# Altium schematic sheet usb.SchDoc
size A4; SheetNumber: 2; SheetTotal: 2
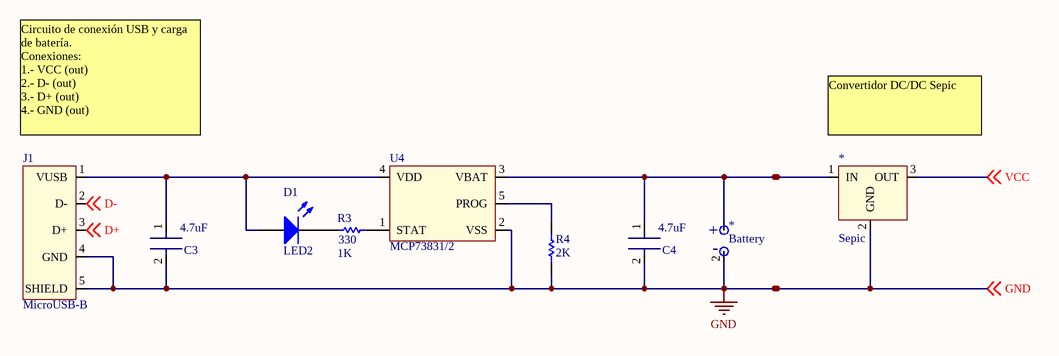
[diagram p0: usb.SchDoc]

## Parts
(Parts that share a designator on the sheet are numbered #1, #2 ... from top to bottom, then left to right.)
*#1  Sepic
*#2  Battery
C3  4.7uF  [Capacitor EIA 1206]
C4  4.7uF  [Capacitor EIA 1206]
D1  LED2  [3.2X1.6X1.1]
J1  MicroUSB-B
R3  330  value 1K  [3216[1206]]
R4  2K  [3216[1206]]
U4  MCP73831/2

## Nets
GND: *#1.2(GND) *#2.2 C3.2 C4.2 J1.4(GND) J1.5(SHIELD) R4.1 U4.2(VSS) ; off-sheet GND
D+: J1.3(D+) ; off-sheet D+
D-: J1.2(D-) ; off-sheet D-
VCC: *#1.3(OUT) ; off-sheet VCC
Net*#1_1: *#1.1(IN) *#2.1 C4.1 U4.3(VBAT)
NetC3_1: C3.1 D1.1(A) J1.1(VUSB) U4.4(VDD)
NetD1_2: D1.2(K) R3.1
NetR3_2: R3.2 U4.1(STAT)
NetR4_2: R4.2 U4.5(PROG)

## Notes on the sheet
- (near J1) Circuito de conexión USB y carga de batería.
  Conexiones:
  1.- VCC (out)
  2.- D- (out)
  3.- D+ (out)
  4.- GND (out)
- (near *#1) Convertidor DC/DC Sepic
- (in symbol Battery) +; -

## Library data of the parts
C3 C4 = TDK C3216X7R1C106K
D1 = LED2: Typical RED, GREEN, YELLOW, AMBER GaAs LED; Published: 8-Jun-2000; LatestRevisionDate: 17-Jul-2002; LatestRevisionNote: Re-released for DXP Platform.; PackageDocument: Feb-2002; PackageReference: 3.2X1.6X1.1; Publisher: Altium Limited
R3 R4 = Res Semi: Semiconductor Resistor; Published: 8-Jun-2000; LatestRevisionDate: 17-Jul-2002; LatestRevisionNote: Re-released for DXP Platform.; PackageReference: AXIAL-0.5; Publisher: Altium Limited